# Altium schematic sheet [04] - COMMUNICATION.SchDoc
size A3; DocumentNumber: 4; SheetNumber: 4; SheetTotal: 9
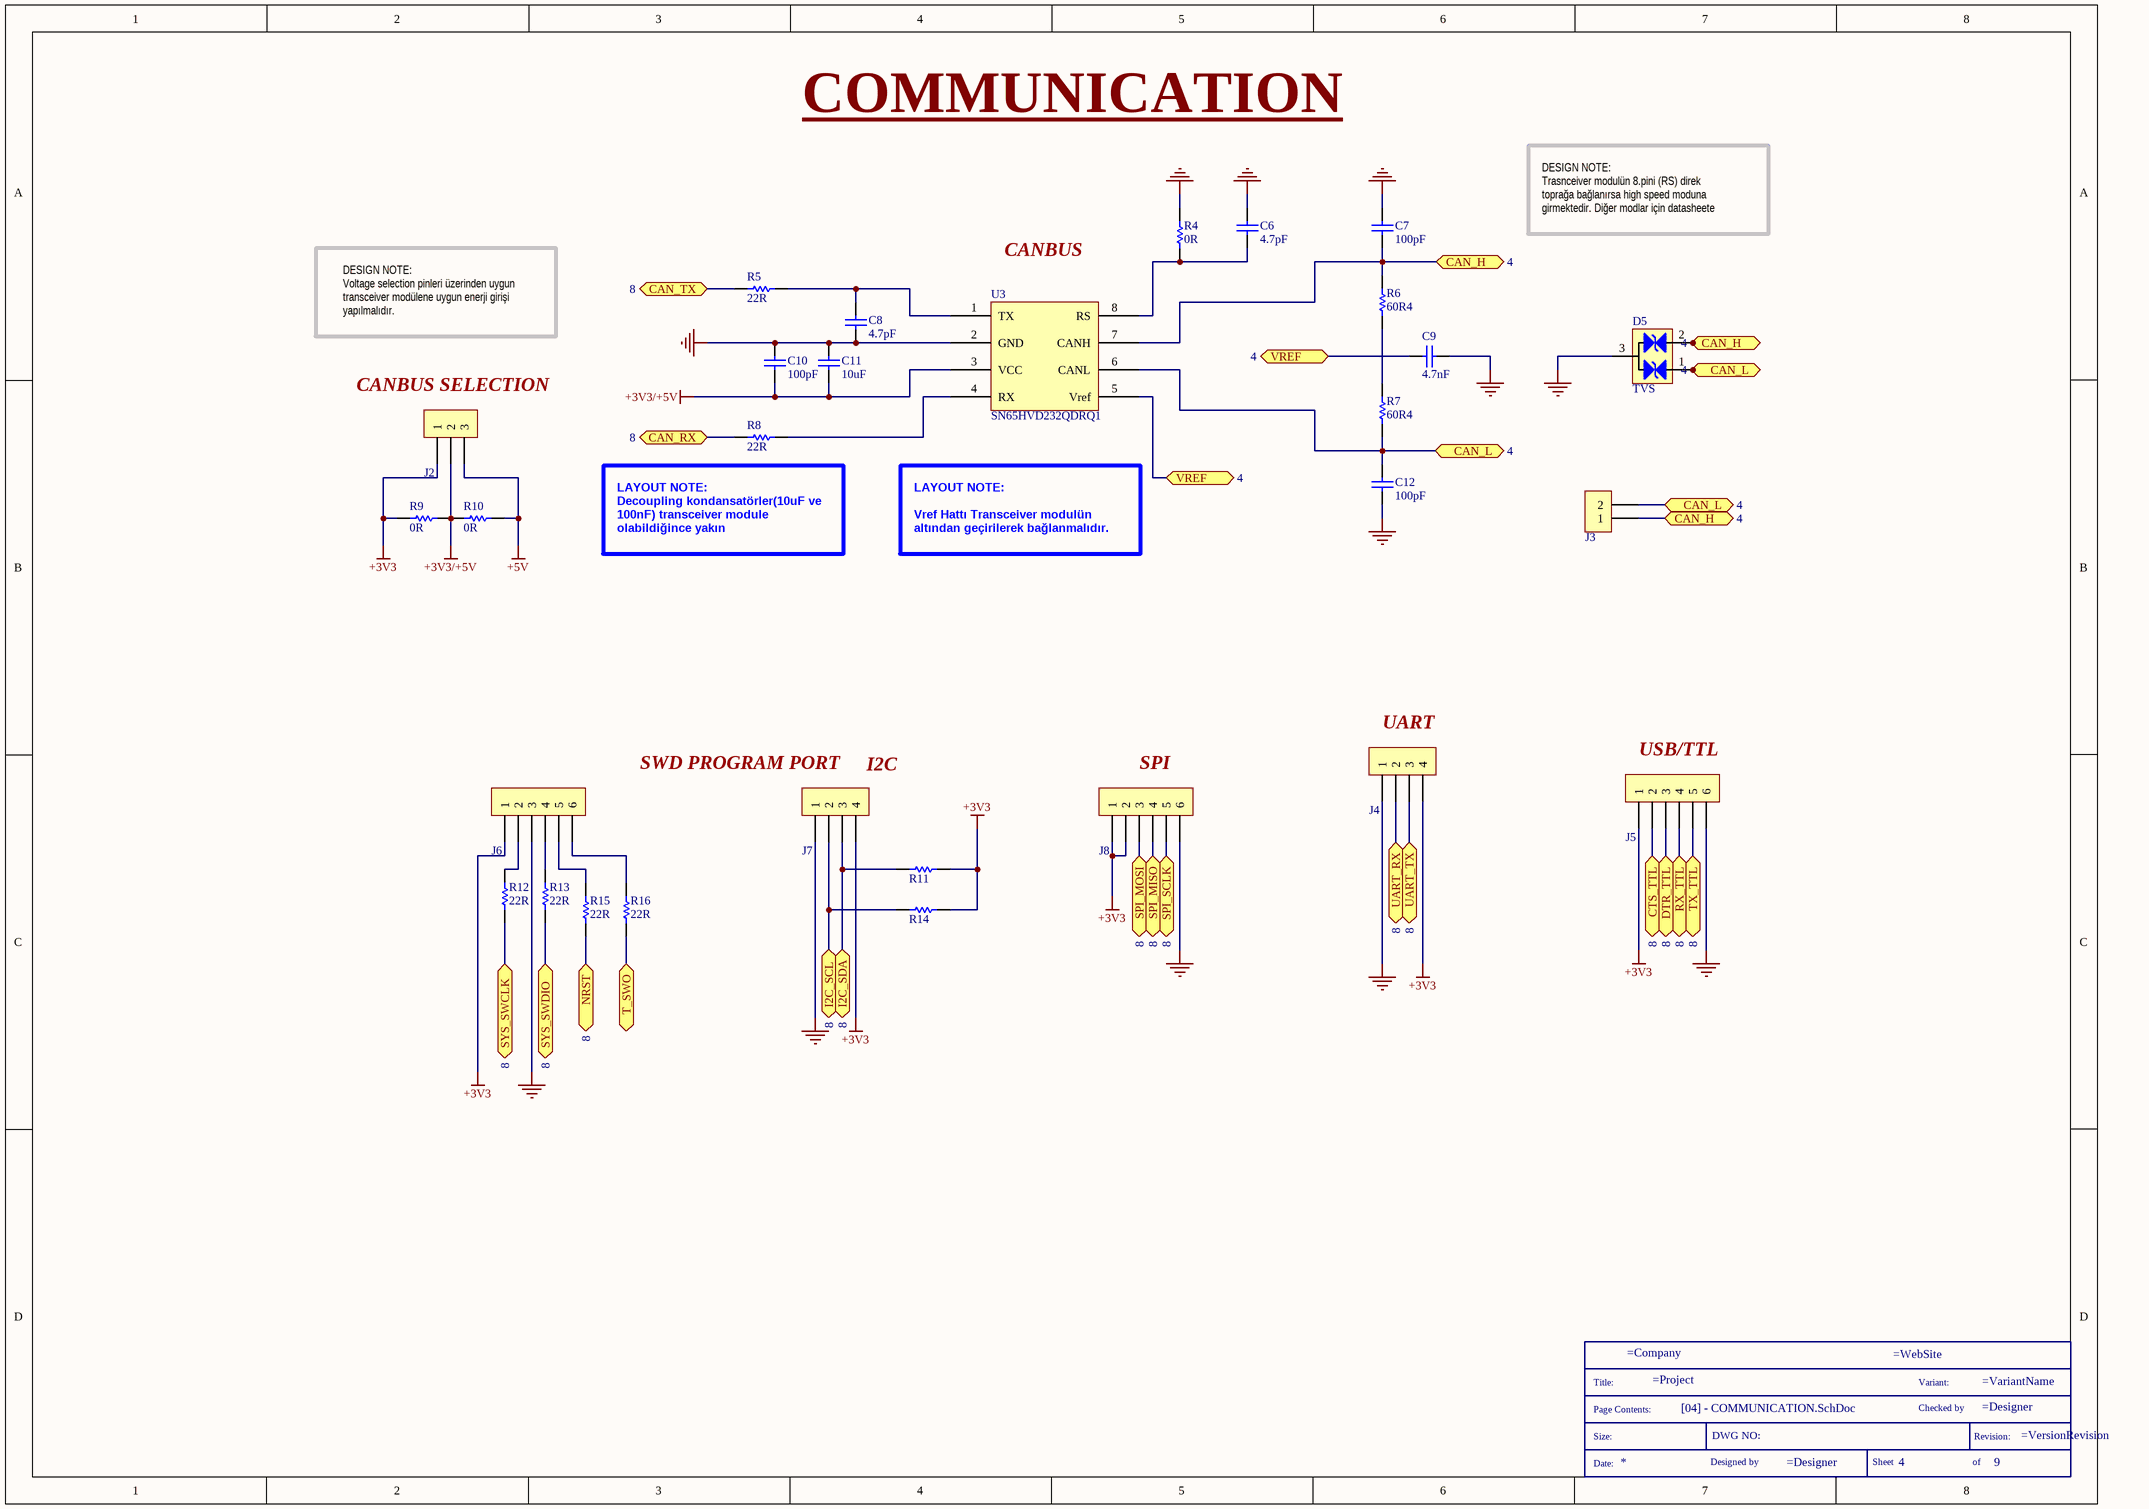
[diagram p0: [04] - COMMUNICATION.SchDoc]

## Parts
*  SCH_TITLE  (value not drawn)  (graphical)
C6  4.7pF  [C0603]
C7  100pF  [C0805]
C8  4.7pF  [C0603]
C9  4.7nF  [C0603]
C10  100pF  [C0805]
C11  10uF  [C0805]
C12  100pF  [C0805]
D5  TVS  [SOT23-3]
J2  HDR_1X3_2.54  [HDR_MALE_1X3_2.54MM]  (value not drawn)
J3  PPTC021LFBN-RC  [2POS_2.54mmPitch]  (value not drawn)
J4  HDR FEMALE 1X4 2.54MM  [HDR_FEMALE_1X4_2.54MM]  (value not drawn)
J5  HDR FEMALE 1X6 2.54MM  [HDR_FEMALE_1X6_2.54MM]  (value not drawn)
J6  HDR FEMALE 1X6 2.54MM  [HDR_FEMALE_1X6_2.54MM]  (value not drawn)
J7  HDR FEMALE 1X4 2.54MM  [HDR_FEMALE_1X4_2.54MM]  (value not drawn)
J8  HDR FEMALE 1X6 2.54MM  [HDR_FEMALE_1X6_2.54MM]  (value not drawn)
R4  0R  [R0805]
R5  22R  [R0805]
R6  60R4  [R0805]
R7  60R4  [R0805]
R8  22R  [R0805]
R9  0R  [R0805]
R10  0R  [R0805]
R11  5.6k 1/8W  [RES_0805]  (value not drawn)
R12  22R  [R0805]
R13  22R  [R0805]
R14  5.6k 1/8W  [RES_0805]  (value not drawn)
R15  22R  [R0805]
R16  22R  [R0805]
U3  SN65HVD232QDRQ1  [SOIC8]

## Ports
CAN_H (see 4), CAN_L (see 4), CAN_RX (see 8), CAN_TX (see 8), CTS_TTL (see 8), DTR_TTL (see 8), I2C_SCL (see 8), I2C_SDA (see 8), NRST (see 8), RX_TTL (see 8), SPI_MISO (see 8), SPI_MOSI (see 8), SPI_SCLK (see 8), SYS_SWCLK (see 8), SYS_SWDIO (see 8), T_SWO, TX_TTL (see 8), UART_RX (see 8), UART_TX (see 8), VREF (see 4)

## Nets
+3V3: J2.1 J4.4 J5.1 J6.1 J7.4 J8.1 J8.2 R9.1 R11.2 R14.2
+3V3/+5V: C10.1 C11.1 J2.2 R9.2 R10.2 U3.3(VCC)
+5V: J2.3 R10.1
GND: C6.2 C7.2 C8.1 C9.2 C10.2 C11.2 C12.1 D5.3 J4.1 J5.6 J6.3 J7.1 J8.6 R4.2 U3.2(GND)
CAN_H: C7.1 J3.1 R6.2 U3.7(CANH) ; port CAN_H
CAN_L: C12.2 J3.2 R7.1 U3.6(CANL) ; port CAN_L
CAN_RX: R8.1 ; port CAN_RX
CAN_TX: R5.1 ; port CAN_TX
CTS_TTL: J5.2 ; port CTS_TTL
DTR_TTL: J5.3 ; port DTR_TTL
I2C_SCL: J7.2 R14.1 ; port I2C_SCL
I2C_SDA: J7.3 R11.1 ; port I2C_SDA
NRST: R15.1 ; port NRST
RX_TTL: J5.4 ; port RX_TTL
SPI_MISO: J8.4 ; port SPI_MISO
SPI_MOSI: J8.3 ; port SPI_MOSI
SPI_SCLK: J8.5 ; port SPI_SCLK
SYS_SWCLK: R12.1 ; port SYS_SWCLK
SYS_SWDIO: R13.1 ; port SYS_SWDIO
T_SWO: R16.1 ; port T_SWO
TX_TTL: J5.5 ; port TX_TTL
UART_RX: J4.2 ; port UART_RX
UART_TX: J4.3 ; port UART_TX
VREF: C9.1 U3.5(Vref) ; port VREF
NetC6_1: C6.1 R4.1 U3.8(RS)
NetC8_2: C8.2 R5.2 U3.1(TX)
NetJ6_2: J6.2 R12.2
NetJ6_4: J6.4 R13.2
NetJ6_5: J6.5 R15.2
NetJ6_6: J6.6 R16.2
NetR6_1: R6.1 R7.2
NetR8_2: R8.2 U3.4(RX)

Not connected (* = marked no-connect by the designer): D5 1 2

## Notes on the sheet
- COMMUNICATION
- DESIGN NOTE:
  Trasnceiver modulün 8.pini (RS) direk toprağa bağlanırsa high speed moduna girmektedir. Diğer modlar için datasheete bakınız
- CANBUS
- DESIGN NOTE:
  Voltage selection pinleri üzerinden uygun transceiver modülene uygun enerji girişi yapılmalıdır.
- (near J2) CANBUS SELECTION
- (near R8) LAYOUT NOTE:
  Decoupling kondansatörler(10uF ve 100nF) transceiver module olabildiğince yakın konumlandırılmalıdır.
- LAYOUT NOTE:
  Vref Hattı Transceiver modulün altından geçirilerek bağlanmalıdır.
- (near J6) SWD PROGRAM PORT
- (near J7) I2C
- (near J8) SPI
- (near J4) UART
- (near J5) USB/TTL
- (in symbol SCH_TITLE) Title:; Variant:; Page Contents:; Checked by; Size:; DWG NO:; Revision:; Date:; Designed by; Sheet; of

## Library data of the parts
* = SCH_TITLE: Schematic information
C6 C8 = CGA3E2C0G1H4R7C080AA: CAP CER 4.7PF 50V C0G 0603; Manufacturer 1: TDK Corporation; Category: Ceramic Capacitors; Manufacturer Part Number 1: CGA3E2C0G1H4R7C080AA; Case/Package: 0603 (1608 Metric); Quantity: 2; Supplier 1: Digikey; Supplier Part Number 1: 445-5621-1-ND; Supplier Order Qty 1: 1; Supplier Stock 1: 2040; Supplier Unit Price 1: 0,21; Supplier Currency 1: $
C7 C10 C12 = CGJ4C2C0G2A101J060AA: CAP CER 100PF 100V C0G 0805; Manufacturer 1: TDK Corporation; Category: Ceramic Capacitors; Manufacturer Part Number 1: CGJ4C2C0G2A101J060AA; Case/Package: 0805 (2012 Metric); Quantity: 2; Descripiton: CAP CER 100PF 100V C0G 0805; Supplier 1: Digikey; Supplier Part Number 1: 445-9158-1-ND; Supplier Order Qty 1: 1; Supplier Stock 1: 8803; Supplier Unit Price 1: 0,32; Supplier Currency 1: $
C9 = CGA3E2X7R1H472K080AA: CAP CER 4700PF 50V X7R 0603; Manufacturer 1: TDK Corporation; Category: Ceramic Capacitors; Manufacturer Part Number 1: CGA3E2X7R1H472K080AA; Case/Package: 0603 (1608 Metric); Quantity: 1; Supplier 1: Digikey; Supplier Part Number 1: 445-5661-1-ND; Supplier Stock 1: 286028; Supplier Order Qty 1: 1; Supplier Unit Price 1: 0,21; Supplier Currency 1: $
C11 = CGA4J3X5R1A106K125AB: CAP CER 10UF 10V X5R 0805; Manufacturer 1: TDK Corporation; Category: Ceramic Capacitors; Manufacturer Part Number 1: CGA4J3X5R1A106K125AB; Case/Package: 0805 (2012 Metric); Quantity: 1; Supplier 1: Digikey; Supplier Part Number 1: 445-6970-1-ND; Supplier Order Qty 1: 1; Supplier Unit Price 1: 0,41; Supplier Currency 1: $; Supplier Stock 1: 278119
D5 = ESDCAN24-2BLY: TVS DIODE 24V 40V SOT23-3; Manufacturer 1: STMicroelectronics; Category: TVS - Diodes; Manufacturer Part Number 1: ESDCAN24-2BLY; Case/Package: TO-236-3, SC-59, SOT-23-3; Quantity: 1; Supplier 1: Digikey; Supplier Part Number 1: 497-13262-1-ND; Supplier Order Qty 1: 1; Supplier Stock 1: 89012; Supplier Unit Price 1: 0,39; Supplier Currency 1: $
J2 = 61300311121: HDR MALE 1X3 2.54MM; Manufacturer 1: Wurth Electronics Inc.; Category: Rectangular Connectors - Headers, Male Pins; Manufacturer Part Number 1: 61300311121; Case/Package: 3POS pitch 2.54mm; Quantity: 1; Supplier 1: Digikey; Supplier Part Number 1: 732-5316-ND; Supplier Order Qty 1: 1; Supplier Stock 1: 109116; Supplier Unit Price 1: 0,13; Supplier Currency 1: $
J3 = PPTC021LFBN-RC: 2POS 0.1 TIN PCB 2.54mm Pitch; Manufacturer 1: Sullins Connector Solutions; Category: Rectangular Connectors - Headers, Receptacles, Female Sockets; Manufacturer Part Number 1: PPTC021LFBN-RC; Case/Package: 2POS_2.54mmPitch; Quantity: 1; Supplier 1: Digikey; Supplier Part Number 1: S7000-ND; Supplier Order Qty 1: 1; Supplier Stock 1: 46723; Supplier Unit Price 1: 0,32; Supplier Currency 1: $
J4 J7 = PPTC041LFBN-RC: Manufacturer 1: Sullins Connector Solutions; Category: Rectangular Connectors - Headers, Receptacles, Female Sockets; Case/Package: 4POS_2.54mmPitch; Manufacturer Part Number 1: PPTC041LFBN-RC; Quantity: 1; Supplier 1: Digikey; Supplier Part Number 1: S7002-ND; Supplier Order Qty 1: 1; Supplier Stock 1: 30769; Supplier Unit Price 1: 0,45; Supplier Currency 1: $
J5 J6 J8 = PPTC061LFBN-RC: Manufacturer 1: Sullins Connector Solutions; Category: Rectangular Connectors - Headers, Receptacles, Female Sockets; Manufacturer Part Number 1: PPTC061LFBN-RC; Case/Package: 6Pos_2.5mm_Pitch; Quantity: 1; Supplier 1: Digikey; Supplier Part Number 1: S7004-ND; Supplier Order Qty 1: 1; Supplier Stock 1: 18444; Supplier Unit Price  1: 0,52; Supplier Currency 1: $
R4 R9 R10 = CRCW08050000Z0EA: RES SMD 0 OHM JUMPER 1/8W 0805; Manufacturer 1: Vishay Dale; Category: Chip Resistor - Surface Mount; Manufacturer Part Number 1: CRCW08050000Z0EA; Case/Package: 0805 (2012 Metric); Quantity: 1; Supplier 1: Digikey; Supplier Part Number 1: 541-0.0ACT-ND; Supplier Order Qty 1: 1; Supplier Stock 1: 609778; Supplier Unit Price 1: 0,10; Supplier Currency 1: $
R5 R8 R12 R13 R15 R16 = CRCW080522R0JNEA: RES SMD 22 OHM 5% 1/8W 0805; Manufacturer 1: Vishay Dale; Category: Chip Resistor - Surface Mount; Manufacturer Part Number 1: CRCW080522R0JNEA; Case/Package: 0805 (2012 Metric); Quantity: 2; Supplier 1: Digikey; Supplier Part Number 1: 541-22ACT-ND; Supplier Order Qty 1: 1; Supplier Stock 1: 53471; Supplier Unit Price 1: 0,10; Supplier Currency 1: $
R6 R7 = CRCW080560R4FKEA: RES SMD 60.4 OHM 1% 1/8W 0805; Manufacturer 1: Vishay Dale; Category: Chip Resistor - Surface Mount; Manufacturer Part Number 1: CRCW080560R4FKEA; Case/Package: 0805 (2012 Metric); Quantity: 2; Supplier 1: Digikey; Supplier Part Number 1: 541-60.4CCT-ND; Supplier Order Qty 1: 1; Supplier Stock 1: 49809; Supplier Unit Price 1: 0,10; Supplier Currency 1: $
R11 R14 = ERJ-6ENF5601V: RES SMD 5.6K OHM 1% 1/8W 0805; Manufacturer 1: Panasonic Electronic Components; Category: Chip Resistor - Surface Mount; Manufacturer Part Number 1: ERJ-6ENF5601V; Case/Package: 0805 (2012 Metric); Quantity: 1; Supplier 1: Digikey; Supplier Part Number 1: P5.60KCCT-ND; Supplier Order Qty 1: 1; Supplier Stock 1: 71341; Supplier Unit Price 1: 0,1; Supplier Currency 1: $
U3 = SN65HVD232QDRQ1: IC TXRX CAN 1MBPS 3.3V 8SOIC; Manufactuer 1: Texas Instruments; Category: Interface - Drivers, Receivers, Transceivers; Manufacturer Part Number 1: SN65HVD232QDRQ1; Case/Package: 8-SOIC (0.154", 3.90mm Width); Quantity: 1; Supplier 1: Digikey; Supplier Part Number 1: 296-15381-1-ND; Supplier Order Qty 1: 1; Supplier Stock 1: 16386; Supplier Unit Price 1: 2,37; Supplier Currency 1: $